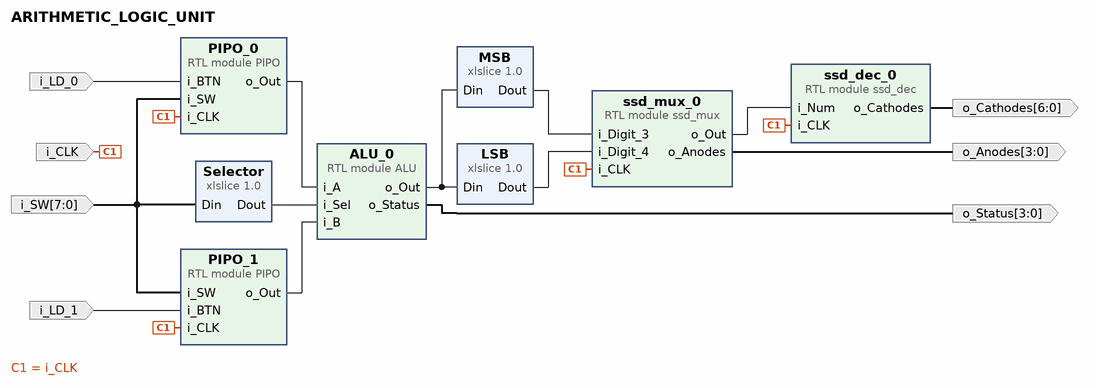
[diagram p0: block diagram of the top level]
# Vivado block design ARITHMETIC_LOGIC_UNIT, xc7z007sclg400-1, Vivado 2018.2
create_bd_design ARITHMETIC_LOGIC_UNIT

create_bd_port -dir I -from 7 -to 0 i_SW
create_bd_port -dir I -type clk i_CLK
set_property -dict {CONFIG.FREQ_HZ 100000000} [get_bd_ports i_CLK]
create_bd_port -dir I i_LD_0
create_bd_port -dir I i_LD_1
create_bd_port -dir O -from 3 -to 0 o_Status
create_bd_port -dir O -from 6 -to 0 o_Cathodes
create_bd_port -dir O -from 3 -to 0 o_Anodes

create_bd_cell -type module -reference PIPO PIPO_0
create_bd_cell -type module -reference PIPO PIPO_1
create_bd_cell -type ip -vlnv xilinx.com:ip:xlslice:1.0 Selector
set_property -dict {CONFIG.DIN_TO 0 CONFIG.DIN_FROM 2 CONFIG.DIN_WIDTH 8 CONFIG.DOUT_WIDTH 3} [get_bd_cells Selector]
create_bd_cell -type ip -vlnv xilinx.com:ip:xlslice:1.0 MSB
set_property -dict {CONFIG.DIN_TO 4 CONFIG.DIN_FROM 7 CONFIG.DIN_WIDTH 8 CONFIG.DOUT_WIDTH 4} [get_bd_cells MSB]
create_bd_cell -type ip -vlnv xilinx.com:ip:xlslice:1.0 LSB
set_property -dict {CONFIG.DIN_TO 0 CONFIG.DIN_FROM 3 CONFIG.DIN_WIDTH 8 CONFIG.DOUT_WIDTH 4} [get_bd_cells LSB]
create_bd_cell -type module -reference ssd_dec ssd_dec_0
create_bd_cell -type module -reference ssd_mux ssd_mux_0
create_bd_cell -type module -reference ALU ALU_0

# ---- connections ----

connect_bd_net [get_bd_pins PIPO_0/o_Out] [get_bd_pins ALU_0/i_A]
connect_bd_net [get_bd_pins PIPO_1/o_Out] [get_bd_pins ALU_0/i_B]
connect_bd_net -net i_SW_0_1 [get_bd_ports i_SW] [get_bd_pins PIPO_1/i_SW] [get_bd_pins PIPO_0/i_SW] [get_bd_pins Selector/Din]
connect_bd_net -net clk_100MHz_1 [get_bd_ports i_CLK] \
  [get_bd_pins PIPO_1/i_CLK] [get_bd_pins PIPO_0/i_CLK] [get_bd_pins ssd_dec_0/i_CLK] [get_bd_pins ssd_mux_0/i_CLK]
connect_bd_net -net i_BTN_0_1 [get_bd_ports i_LD_0] [get_bd_pins PIPO_0/i_BTN]
connect_bd_net -net i_BTN_1_1 [get_bd_ports i_LD_1] [get_bd_pins PIPO_1/i_BTN]
connect_bd_net -net xlslice_0_Dout [get_bd_pins Selector/Dout] [get_bd_pins ALU_0/i_Sel]
connect_bd_net [get_bd_pins ALU_0/o_Out] [get_bd_pins MSB/Din] [get_bd_pins LSB/Din]
connect_bd_net [get_bd_pins ALU_0/o_Status] [get_bd_ports o_Status]
connect_bd_net [get_bd_pins ssd_dec_0/o_Cathodes] [get_bd_ports o_Cathodes]
connect_bd_net [get_bd_pins ssd_mux_0/o_Anodes] [get_bd_ports o_Anodes]
connect_bd_net [get_bd_pins ssd_mux_0/o_Out] [get_bd_pins ssd_dec_0/i_Num]
connect_bd_net [get_bd_pins MSB/Dout] [get_bd_pins ssd_mux_0/i_Digit_3]
connect_bd_net [get_bd_pins LSB/Dout] [get_bd_pins ssd_mux_0/i_Digit_4]

validate_bd_design
save_bd_design
